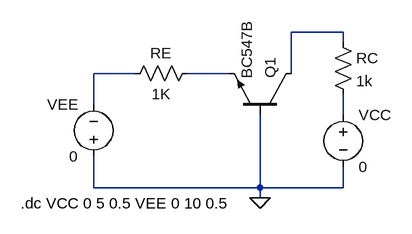
[diagram p0: schematic Common Base.asc]
Common Base.asc, the LTspice schematic file:
Version 4
SHEET 1 880 680
WIRE 432 192 352 192
WIRE 432 208 432 192
WIRE 112 256 48 256
WIRE 256 256 192 256
WIRE 352 256 352 192
WIRE 48 304 48 256
WIRE 432 320 432 288
WIRE 48 432 48 384
WIRE 304 432 304 320
WIRE 304 432 48 432
WIRE 432 432 432 400
WIRE 432 432 304 432
WIRE 304 448 304 432
FLAG 304 448 0
SYMBOL voltage 48 400 R180
WINDOW 0 24 96 Left 2
WINDOW 3 24 16 Left 2
SYMATTR InstName VEE
SYMATTR Value 0
SYMBOL voltage 432 304 R0
SYMATTR InstName VCC
SYMATTR Value 0
SYMBOL res 208 240 R90
WINDOW 0 0 56 VBottom 2
WINDOW 3 32 56 VTop 2
SYMATTR InstName RE
SYMATTR Value 1K
SYMBOL npn 352 320 M270
SYMATTR InstName Q1
SYMATTR Value BC547B
SYMBOL res 416 192 R0
SYMATTR InstName RC
SYMATTR Value 1k
TEXT -64 456 Left 2 !.dc VCC 0 5 0.5 VEE 0 10 0.5

The netlist it stands for:
* Common Base.asc
VEE 0 N002 0
VCC N004 0 0
RE N003 N002 1K
Q1 N001 0 N003 0 BC547B
RC N001 N004 1k
.model NPN NPN
.model PNP PNP
.lib standard.bjt
.dc VCC 0 5 0.5 VEE 0 10 0.5
.backanno
.end